# Altium schematic sheet InverterSCH.SchDoc
size 420 x 297 mm; SheetNumber: 1; SheetTotal: 1
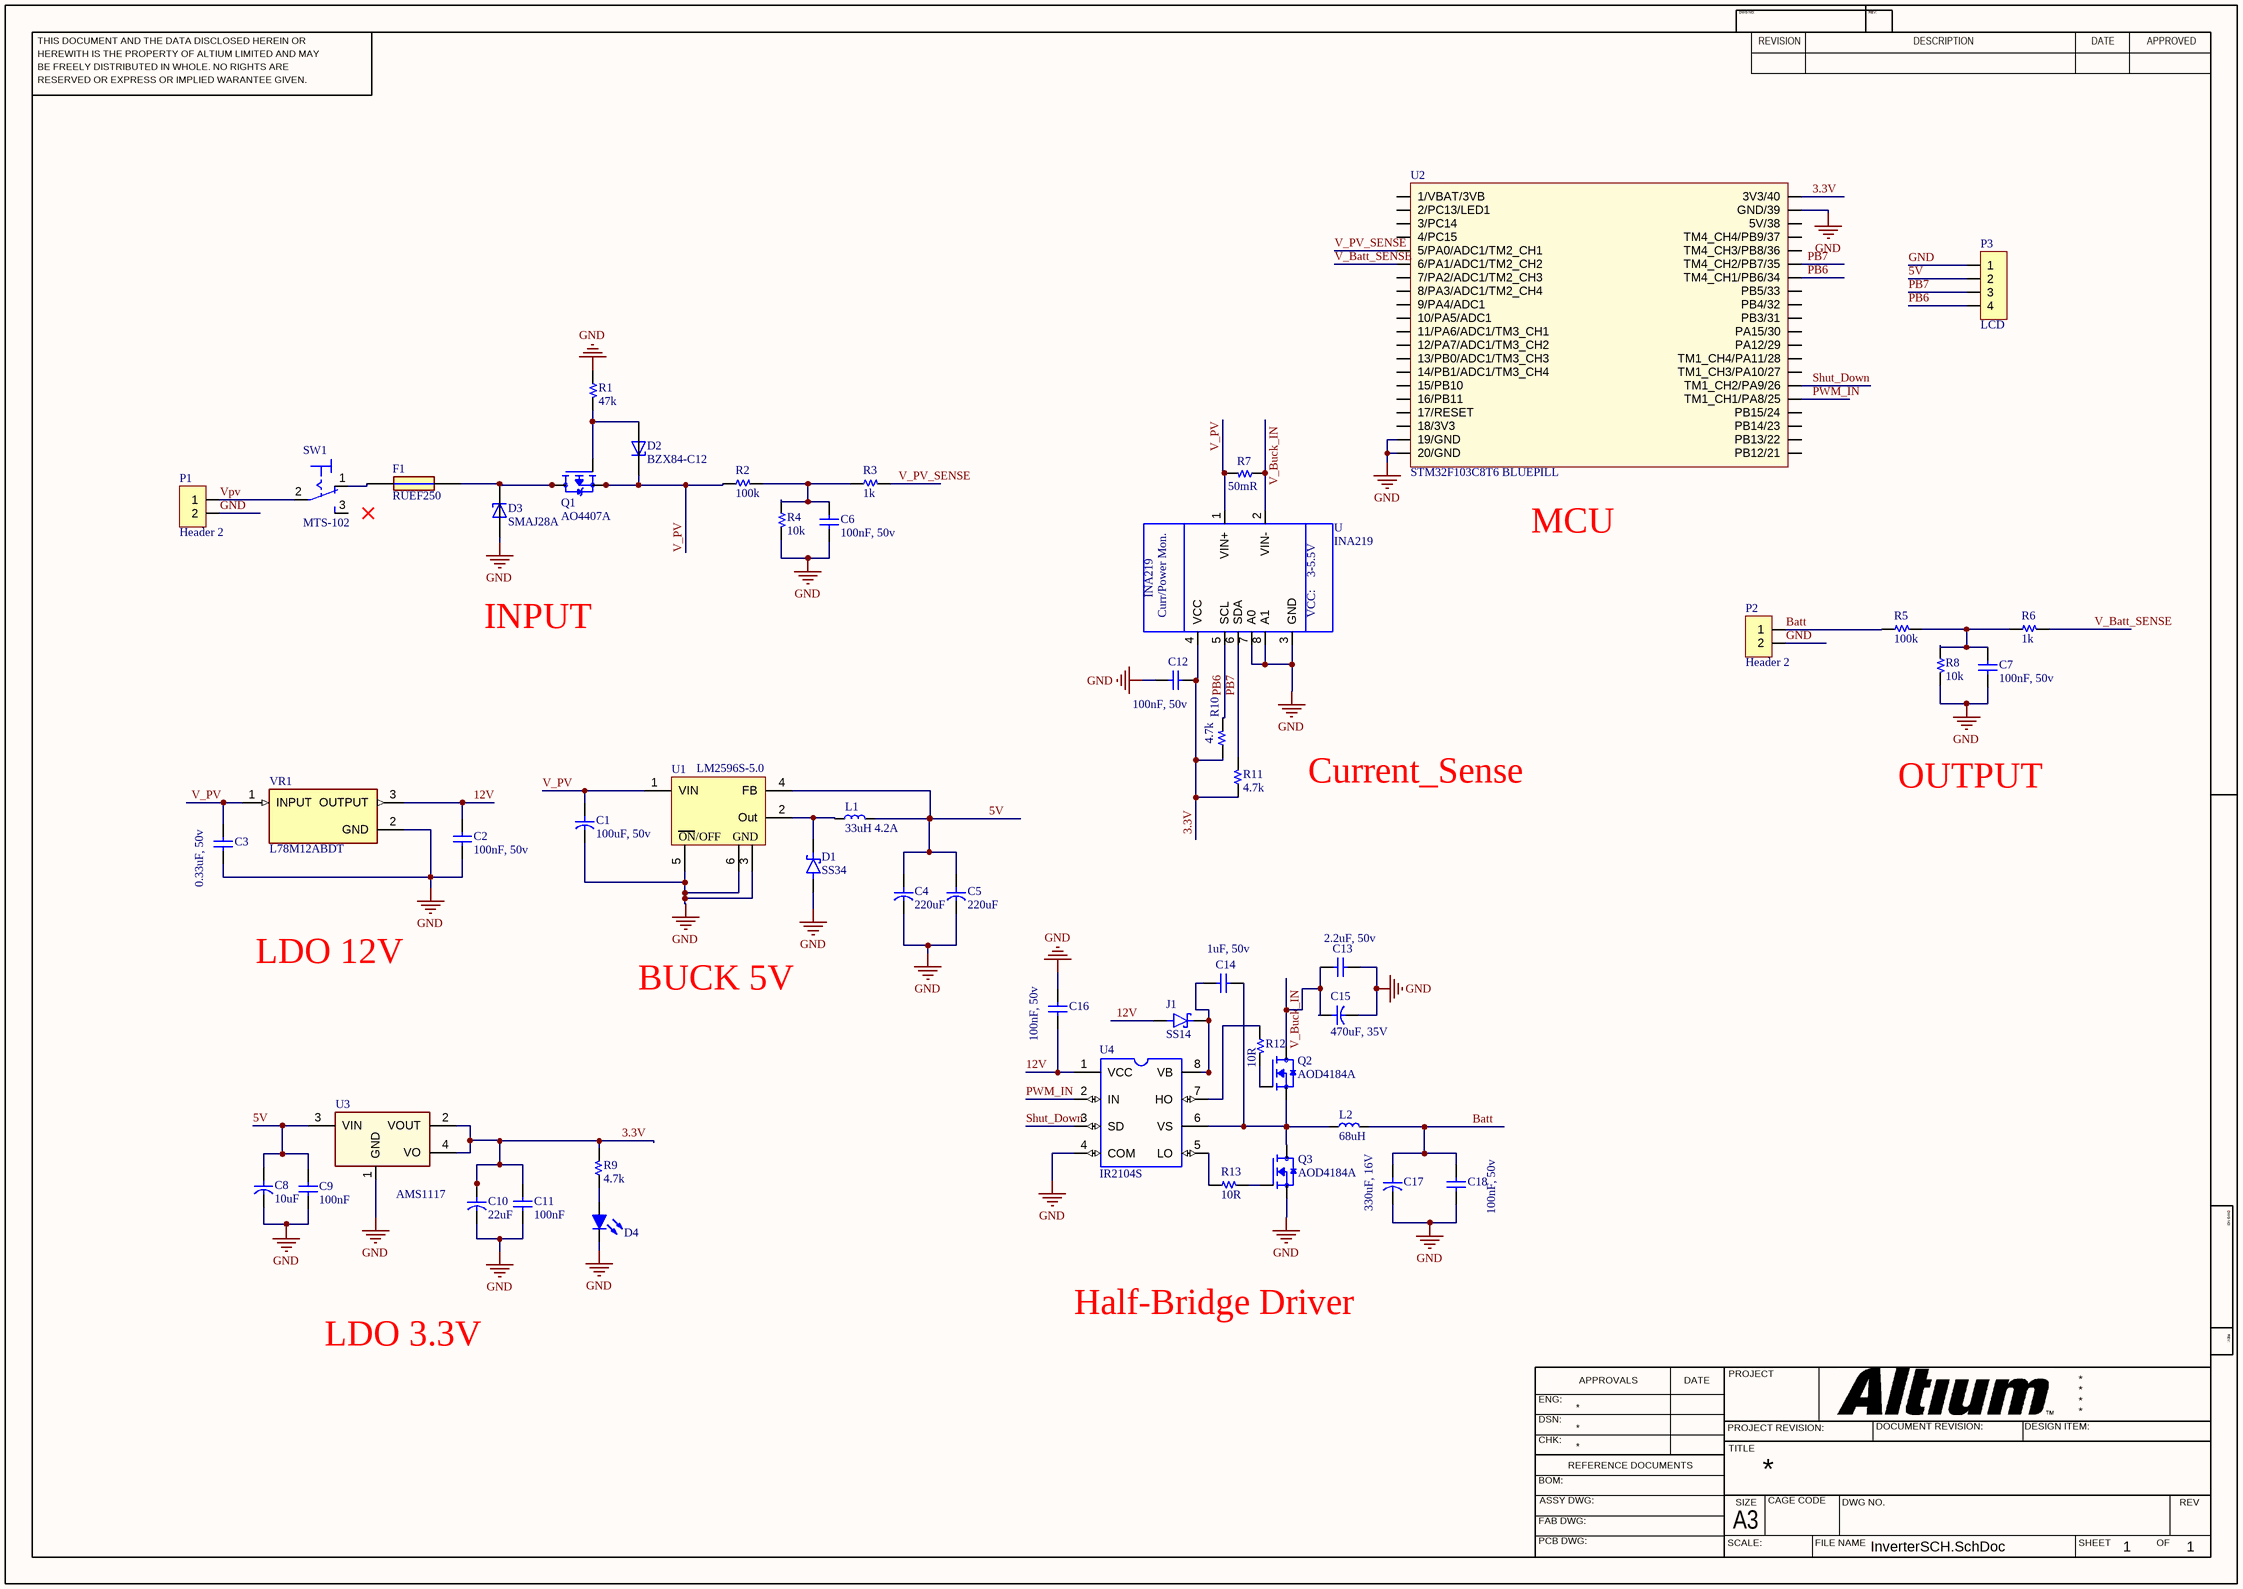
[diagram p0: InverterSCH.SchDoc]

## Parts
C1  100uF, 50v  [C SMD TAN 2917 (E)]
C2  100nF, 50v  [C 0603]
C3  0.33uF, 50v  [C 0805]
C4  220uF  [C SMD TAN 2312 (C)]
C5  220uF  [C SMD TAN 2312 (C)]
C6  100nF, 50v  [C 0603]
C7  100nF, 50v  [C 0603]
C8  10uF  [C SMD ALU (B)]
C9  100nF  [C 0805]
C10  22uF  [C SMD TAN 2917 (E)]
C11  100nF  [C 0805]
C12  100nF, 50v  [C 0603]
C13  2.2uF, 50v  [C 1206]
C14  1uF, 50v  [C 0603]
C15  470uF, 35V  [C SMD ALU (D8)]
C16  100nF, 50v  [C 0603]
C17  330uF, 16V  [C SMD TAN 2917 (E)]
C18  100nF, 50v  [C 0603]
D1  SS34  [DIOM7959X265N]
D2  BZX84-C12  [SOT95P230X110-3N]
D3  SMAJ28A  [DIOM4325X250N]
D4  Led  [LED 3MM - green]  (value not drawn)
F1  RUEF250  [RUEF250]
J1  SS14  [SMA]
L1  33uH 4.2A  [Inductor SMD 12x12x8]
L2  68uH  [Inductor SMD 12x12x8]
P1  Header 2  [HDR/Terminal/2]
P2  Header 2  [HDR/Terminal/2]
P3  LCD  [HDR/Header/4/BOX]
Q1  AO4407A  [SOIC127P600X175-8N]
Q2  AOD4184A  [DPAK228P994X240-4N]
Q3  AOD4184A  [DPAK228P994X240-4N]
R1  47k  [R 0603]
R2  100k  [R 0603]
R3  1k  [R 0603]
R4  10k  [R 0805]
R5  100k  [R 0603]
R6  1k  [R 0603]
R7  50mR  [R 2512]
R8  10k  [R 0603]
R9  4.7k  [R 1206]
R10  4.7k  [R 0603]
R11  4.7k  [R 0603]
R12  10R  [R 0805]
R13  10R  [R 0805]
SW1  MTS-102  [MTS-102]
U  INA219  [SOT23-8]
U1  LM2596S-5.0  [TO-263-5]
U2  STM32F103C8T6 BLUEPILL  [Female header 20x20 pin]
U3  AMS1117  [SOT-223]
U4  IR2104S  [IR2104S]
VR1  L78M12ABDT  [VREG_L78M12ABDT]

## Nets
GND: C1.2 C2.1 C3.2 C4.2 C5.2 C6.1 C7.1 C8.2 C9.2 C10.2 C11.2 C12.2 C13.1 C15.2 C16.2 C17.2 C18.1 D1.A D3.A D4.2(K) P1.2 P2.2 P3.1 Q3.3(S) R1.1 R4.2 R8.2 U.3(GND) U.7(A0) U.8(A1) U1.3(GND) U1.5(~{ON}/OFF) U1.6(PAD) U2.19(19/GND) U2.20(20/GND) U2.39(GND/39) U3.1(GND) U4.4(COM) VR1.2(GND)
3.3V: C10.1 C11.1 C12.1 R9.2 R10.1 R11.1 U.4(VCC) U2.40(3V3/40) U3.2(VOUT) U3.4(VO)
5V: C4.1 C5.1 C8.1 C9.1 L1.2 P3.2 U1.4(FB) U3.3(VIN)
12V: C2.2 C16.1 J1.P1(A) U4.1(VCC) VR1.3(OUTPUT)
Batt: C17.1 C18.2 L2.2 P2.1 R5.1
PB6: P3.4 R10.2 U.5(SCL) U2.34(TM4_CH1/PB6/34)
PB7: P3.3 R11.2 U.6(SDA) U2.35(TM4_CH2/PB7/35)
PWM_IN: U2.25(TM1_CH1/PA8/25) U4.2(IN)
Shut_Down: U2.26(TM1_CH2/PA9/26) U4.3(SD)
V_Batt_SENSE: R6.2 U2.6(6/PA1/ADC1/TM2_CH2)
V_Buck_IN: C13.2 C15.1 Q2.4(D) R7.1 U.2(VIN-)
V_PV: C1.1 C3.1 D2.3(C) Q1.1(S) Q1.2(S) Q1.3(S) R2.1 R7.2 U.1(VIN+) U1.1(VIN) VR1.1(INPUT)
V_PV_SENSE: R3.2 U2.5(5/PA0/ADC1/TM2_CH1)
Vpv: P1.1 SW1.2(P)
NetC6_2: C6.2 R2.2 R3.1 R4.1
NetC7_2: C7.2 R5.2 R6.1 R8.1
NetC14_1: C14.1 L2.1 Q2.3(S) Q3.4(D) U4.6(VS)
NetC14_2: C14.2 J1.P2(C) U4.8(VB)
NetD1_C: D1.C(K) L1.1 U1.2(Out)
NetD2_1: D2.1(A) Q1.4(G) R1.2
NetD3_C: D3.C F1.2 Q1.5(D) Q1.6(D) Q1.7(D) Q1.8(D)
NetD4_1: D4.1(A) R9.1
NetF1_1: F1.1 SW1.1(O)
NetQ2_1: Q2.1(G) R12.2
NetQ3_1: Q3.1(G) R13.2
NetR12_1: R12.1 U4.7(HO)
NetR13_1: R13.1 U4.5(LO)

Not connected (* = marked no-connect by the designer): SW1 3(S); U2 1(1/VBAT/3VB) 2(2/PC13/LED1) 3(3/PC14) 4(4/PC15) 7(7/PA2/ADC1/TM2_CH3) 8(8/PA3/ADC1/TM2_CH4) 9(9/PA4/ADC1) 10(10/PA5/ADC1) 11(11/PA6/ADC1/TM3_CH1) 12(12/PA7/ADC1/TM3_CH2) 13(13/PB0/ADC1/TM3_CH3) 14(14/PB1/ADC1/TM3_CH4) 15(15/PB10) 16(16/PB11) 17(17/RESET) 18(18/3V3) 21(PB12/21) 22(PB13/22) 23(PB14/23) 24(PB15/24) 27(TM1_CH3/PA10/27) 28(TM1_CH4/PA11/28) 29(PA12/29) 30(PA15/30) 31(PB3/31) 32(PB4/32) 33(PB5/33) 36(TM4_CH3/PB8/36) 37(TM4_CH4/PB9/37) 38(5V/38)

## Notes on the sheet
- (near U2) MCU
- INPUT
- Current_Sense
- OUTPUT
- LDO 12V
- BUCK 5V
- Half-Bridge Driver
- LDO 3.3V
- THIS DOCUMENT AND THE DATA DISCLOSED HEREIN OR
- HEREWITH IS THE PROPERTY OF ALTIUM LIMITED AND MAY
- DWG NO:
- REVISION
- REV:
- DESCRIPTION
- DATE
- APPROVED
- BE FREELY DISTRIBUTED IN WHOLE. NO RIGHTS ARE
- RESERVED OR EXPRESS OR IMPLIED WARANTEE GIVEN.
- ENG:
- APPROVALS
- PROJECT
- DSN:
- CHK:
- REFERENCE DOCUMENTS
- PROJECT REVISION:
- TITLE
- DOCUMENT REVISION:
- DESIGN ITEM:
- BOM:
- FAB DWG:
- PCB DWG:
- ASSY DWG:
- SCALE:
- A3
- SIZE
- CAGE CODE
- FILE NAME
- DWG NO.
- SHEET
- OF
- REV
- (in symbol INA219) 3-5.5V; Curr/Power Mon.; VCC:
- (in symbol LM2596S-5.0) ON/OFF

## Library data of the parts
C1 C4 C5 C8 C10 C15 C17 = Capacitor: Capacitor pol
C2 C3 C6 C7 C9 C11-C14 C16 C18 = Capacitor NP: Capacitor non-pol
D1 = SS34: Diode Schottky 40 V 3A Surface Mount SMC (DO-214AB); MF: onsemi; SnapEDA_Link: https://www.snapeda.com/parts/SS34/Onsemi/view-part/?ref=snap; Package: SMC-2 ON Semiconductor; Value: *; MP: SS34; Check_prices: https://www.snapeda.com/parts/SS34/Onsemi/view-part/?ref=eda
D2 = BZX84-C12: Zener Diode 12 V 250 mW Â±5% Surface Mount TO-236AB; MF: Nexperia USA; SnapEDA_Link: https://www.snapeda.com/parts/BZX84-C12/Nexperia/view-part/?ref=snap; Package: SOT-23 NXP Semiconductors; Value: *; MP: BZX84-C12; Check_prices: https://www.snapeda.com/parts/BZX84-C12/Nexperia/view-part/?ref=eda
D3 = SMAJ28A: 400W, 32.8V, 5%, Unidirectional, TVS; MF: Taiwan Semiconductor; SnapEDA_Link: https://www.snapeda.com/parts/SMAJ28A/taiwan/view-part/?ref=snap; Package: SMA-2 Taiwan Semiconductor; Value: *; MP: SMAJ28A; Check_prices: https://www.snapeda.com/parts/SMAJ28A/taiwan/view-part/?ref=eda
D4 = Led: Typical LED
F1 = RUEF250: Littelfuse 2.5A Radial Leaded PCB Mount Resettable Fuse, 30V dc; Geometry.Height: 18.3mm; Manufacturer_Name: LITTELFUSE; Manufacturer_Part_Number: RUEF250; Mouser Part Number: 650-RUEF250; Mouser Price/Stock: https://www.mouser.co.uk/ProductDetail/Littelfuse/RUEF250?qs=hv6pn79dJPQsHwuAgSfH9w%3D%3D; Arrow Part Number: RUEF250; Arrow Price/Stock: https://www.arrow.com/en/products/ruef250/littelfuse?utm_currency=USD&region=europe; Datasheet Link: https://www.littelfuse.com/~/media/electronics/product_specifications/resettable_ptcs/littelfuse_ptc_ruef250_product_specification.pdf.pdf
J1 = SS14: Diode Schottky 40 V 1A Surface Mount DO-214AC (SMA); MF: ON; SnapEDA_Link: https://www.snapeda.com/parts/SS14/Onsemi/view-part/?ref=snap; Package: SMA-2 ON Semiconductor; Value: *; MP: SS14; Check_prices: https://www.snapeda.com/parts/SS14/Onsemi/view-part/?ref=eda
L1 L2 = Inductor
P1 P2 = Header 2: Header, 2-Pin
P3 = Header 4: Header, 4-Pin
Q1 = AO4407A: P-Channel 30 V 12A (Ta) 3.1W (Ta) Surface Mount 8-SOIC; MF: Alpha &; SnapEDA_Link: https://www.snapeda.com/parts/AO4407A/Alpha/view-part/?ref=snap; Package: SOIC-8 Alpha &amp; Omega Semiconductor; Value: *; MP: AO4407A; Check_prices: https://www.snapeda.com/parts/AO4407A/Alpha/view-part/?ref=eda
Q2 Q3 = AOD4184A: N-Channel 40 V 13A (Ta), 50A (Tc) 2.3W (Ta), 50W (Tc) Surface Mount TO-252 (DPAK); MF: Alpha & Omega Semiconductor Inc.; SnapEDA_Link: https://www.snapeda.com/parts/AOD4184A/Alpha+%2526+Omega+Semiconductor+Inc./view-part/?ref=snap; Package: None; Value: *; MP: AOD4184A; Check_prices: https://www.snapeda.com/parts/AOD4184A/Alpha+%2526+Omega+Semiconductor+Inc./view-part/?ref=eda
R1-R13 = Resistor
SW1 = MTS-102: Rectangular Cable Assemblies .100 Mini Mate Single Row Discrete Wire Cable Assembly, Terminal; MF: Motorola; MP: MTS102; Availability: Unavailable; Value: *; Package: None; SnapEDA_Link: https://www.snapeda.com/parts/MTS102/Motorola/view-part/698799/?ref=snap; Price: None; Check_prices: https://www.snapeda.com/parts/MTS102/Motorola/view-part/698799/?ref=eda
U = INA219: Current Monitor Regulator High-Side 10mA SOT-23-8; MF: Texas Instruments; Package: SOT-23-8 Texas Instruments; SnapEDA_Link: https://www.snapeda.com/parts/INA219/Texas%20Instruments/view-part/564410/?ref=snap; MP: INA219; Value: *; Availability: Unavailable; Price: None
U1 = LM2596S-5.0: Simple Switcher 3A Step-Down Voltage Regulator
U2 = STM32F103C8T6 KIT BLUE PILL: Connector 9; Value: Connector 9
U3 = AMS1117: 1A LDO Voltage Regulator, ADJ or fixed 1.5/1.8/2.5/2.85/3.3/5V
U4 = IR2104S: Half-Bridge Gate Driver IC Non-Inverting 8-SOIC; MF: Infineon Technologies; SnapEDA_Link: https://www.snapeda.com/parts/IR2104S/Infineon%20Technologies/view-part/582439/?ref=snap; Package: SO-8 Infineon; MP: IR2104S; Price: None; Value: *; Availability: Unavailable
VR1 = L78M12ABDT: Linear Voltage Regulator IC Positive Fixed 1 Output 500mA DPAK; MF: STMicroelectronics; Package: TO-252 STMicroelectronics; Price: None; Value: *; SnapEDA_Link: https://www.snapeda.com/parts/L78M12ABDT/STMicroelectronics/view-part/?ref=snap; MP: L78M12ABDT; Availability: Not in stock; Check_prices: https://www.snapeda.com/parts/L78M12ABDT/STMicroelectronics/view-part/?ref=eda